# Altium schematic sheet DAC_PCM1781.SchDoc
size A4
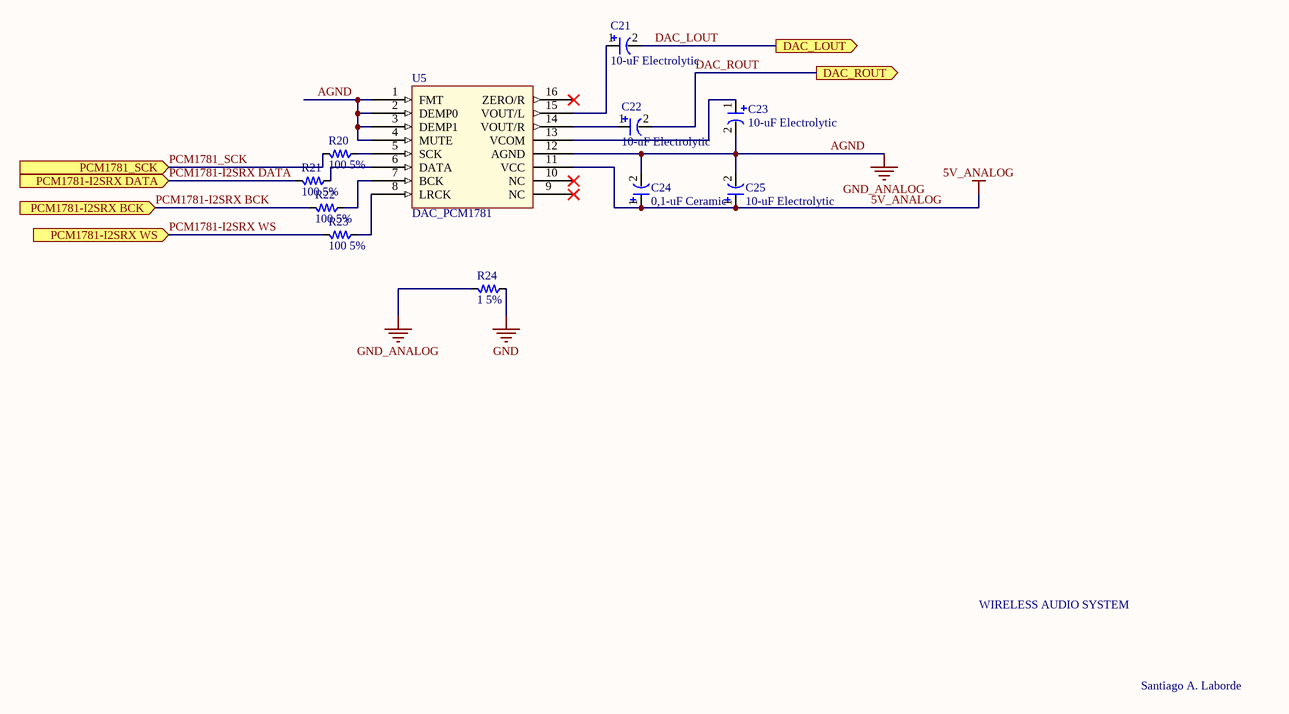
[diagram p0: DAC_PCM1781.SchDoc]

## Parts
C21  10-uF Electrolytic  [14-1210]
C22  10-uF Electrolytic  [14-1210]
C23  10-uF Electrolytic  [14-1210]
C24  0,1-uF Ceramic  [C_0805_Pol]
C25  10-uF Electrolytic  [14-1210]
R20  100 5%  [R_0805]
R21  100 5%  [R_0805]
R22  100 5%  [R_0805]
R23  100 5%  [R_0805]
R24  1 5%  [R_0805]
U5  DAC_PCM1781  [SSOP (16)]

## Ports
DAC_LOUT (out), DAC_ROUT (out), PCM1781-I2SRX BCK (in), PCM1781-I2SRX DATA (in), PCM1781-I2SRX WS (in), PCM1781_SCK (in)

## Nets
5V_ANALOG: C24.1 C25.1 U5.11(VCC)
AGND: C23.2 C24.2 C25.2 R24.1 U5.1(FMT) U5.2(DEMP0) U5.3(DEMP1) U5.4(MUTE) U5.12(AGND)  [also labelled GND_ANALOG]
GND: R24.2
DAC_LOUT: C21.2 ; port DAC_LOUT
DAC_ROUT: C22.2 ; port DAC_ROUT
PCM1781-I2SRX BCK: R22.1 ; port PCM1781-I2SRX BCK
PCM1781-I2SRX DATA: R21.1 ; port PCM1781-I2SRX DATA
PCM1781-I2SRX WS: R23.1 ; port PCM1781-I2SRX WS
PCM1781_SCK: R20.1 ; port PCM1781_SCK
NetC21_1: C21.1 U5.15(VOUT/L)
NetC22_1: C22.1 U5.14(VOUT/R)
NetC23_1: C23.1 U5.13(VCOM)
NetR20_2: R20.2 U5.5(SCK)
NetR21_2: R21.2 U5.6(DATA)
NetR22_2: R22.2 U5.7(BCK)
NetR23_2: R23.2 U5.8(LRCK)

Not connected (* = marked no-connect by the designer): U5 9(NC)* 10(NC)* 16(ZERO/R)*

## Notes on the sheet
- WIRELESS AUDIO SYSTEM
- Santiago A. Laborde

## Library data of the parts
C21-C25 = Capacitor_Pol: Polarysed Capacitor
R20-R24 = Resistor
U5 = DAC_PCM1781: The PCM1780/81/82 is a CMOS, monolithic, integrated circuit, which includes stereo digital-to-analog converters and support circuitry in a small 16-lead SSOP package. The data converters use TI’s enhanced multilevel delta-sigma architecture to achieve excellent dynamic performance an improved tolerance to clock jitter. Sampling rates up to 200 kHz are supported.